# Altium schematic sheet AutomationSystem-Schematic_2022-08-13.schdoc
size 299 x 210 mm
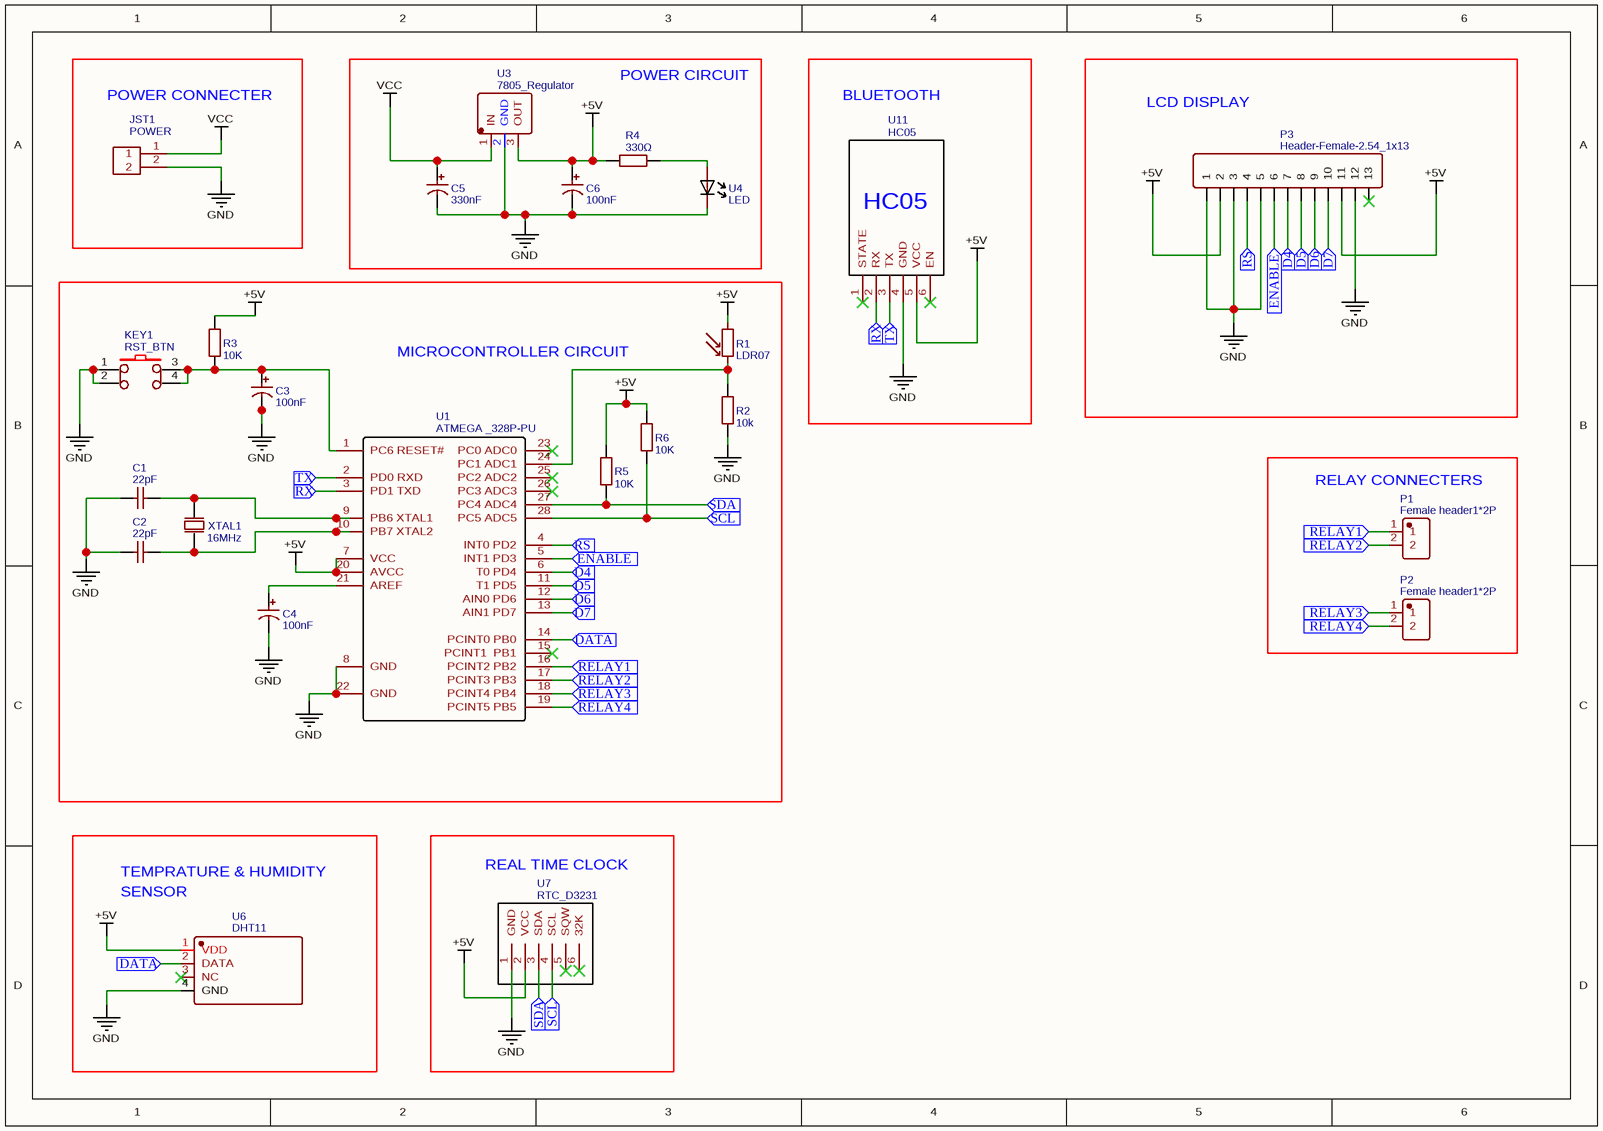
[diagram p0: AutomationSystem-Schematic_2022-08-13.schdoc]

## Parts
C1  22pF  [CAP-TH_L3.5-W3.0-P2.54-D0.8]
C2  22pF  [CAP-TH_L3.5-W3.0-P2.54-D0.8]
C3  100nF  [CAP-TH_BD5.0-P2.00-D0.8-FD]
C4  100nF  [CAP-TH_BD5.0-P2.00-D0.8-FD]
C5  330nF  [CAP-TH_BD5.0-P2.00-D0.8-FD]
C6  100nF  [CAP-TH_BD5.0-P2.00-D0.8-FD]
JST1  POWER  [CONN-TH_XHB-2A]
KEY1  RST_BTN  [KEY-TH_4P-L6.0-W6.0-P4.50]
P1  Female header1*2P  [HDR-TH_2P-P2.00-V]
P2  Female header1*2P  [HDR-TH_2P-P2.00-V]
P3  Header-Female-2.54_1x13  [HDR-TH_13P-P2.54-V-F]
R1  LDR07  [RESISTOR_LDR_5.1X4.3_RM3.4]
R2  10k  [AXIAL-0.4]
R3  10K  [AXIAL-0.4]
R4  330Ω  [AXIAL-0.4]
R5  10K  [AXIAL-0.4]
R6  10K  [AXIAL-0.4]
U1  ATMEGA _328P-PU  [DIP-28_L34.6-W7.3-P2.54-LS10.2-BL]
U3  7805_Regulator  [TO-220-3_L10.0-W4.5-P2.54-L]
U4  LED  [5MM LED]
U6  DHT11  [SENSOR-TH_DHT11]
U7  RTC_D3231  [D3231]
U11  HC05  [HC05]
XTAL1  16MHz  [16MHZ_OSC [PCB]]

## Blocks framed on the sheet
POWER CONNECTER: JST1
POWER CIRCUIT: C5 C6 R4 U3 U4
BLUETOOTH: U11
LCD DISPLAY: P3
MICROCONTROLLER CIRCUIT: C1-C4 KEY1 R1-R3 R5 R6 U1 XTAL1
RELAY CONNECTERS: P1 P2
REAL TIME CLOCK: U7

## Ports
D4 (in), D5 (in), D6 (in), D7 (in), DATA (in), ENABLE (in), RELAY1 (in), RELAY2 (in), RELAY3 (in), RELAY4 (in), RS (in), RX (in), SCL (in), SDA (in), TX (in)

## Nets
+5V: C6.1 P3.2 P3.11 R1.1 R3.2 R4.1 R5.2 R6.2 U1.7(VCC) U1.20(AVCC) U3.3(OUT) U6.1(VDD) U7.2(VCC) U11.5(VCC)
GND: C1.1 C2.1 C3.2 C4.2 C5.2 C6.2 JST1.2 KEY1.1 KEY1.2 P3.1 P3.3 P3.5 P3.12 R2.1 U1.8(GND) U1.22(GND) U3.2(GND) U4.2 U6.4(GND) U7.1(GND) U11.4(GND)
VCC: C5.1 JST1.1 U3.1(IN)
D4: P3.7 U1.6(T0_PD4) ; port D4
D5: P3.8 U1.11(T1_PD5) ; port D5
D6: P3.9 U1.12(AIN0_PD6) ; port D6
D7: P3.10 U1.13(AIN1_PD7) ; port D7
DATA: U1.14(PCINT0_PB0) U6.2(DATA) ; port DATA
ENABLE: P3.6 U1.5(INT1_PD3) ; port ENABLE
RELAY1: P1.1 U1.16(PCINT2_PB2) ; port RELAY1
RELAY2: P1.2 U1.17(PCINT3_PB3) ; port RELAY2
RELAY3: P2.1 U1.18(PCINT4_PB4) ; port RELAY3
RELAY4: P2.2 U1.19(PCINT5_PB5) ; port RELAY4
RS: P3.4 U1.4(INT0_PD2) ; port RS
RX: U1.3(PD1_TXD) U11.2(RX) ; port RX
SCL: R6.1 U1.28(PC5_ADC5) U7.4(SCL) ; port SCL
SDA: R5.1 U1.27(PC4_ADC4) U7.3(SDA) ; port SDA
TX: U1.2(PD0_RXD) U11.3(TX) ; port TX
NetC1_2: C1.2 U1.9(PB6_XTAL1) XTAL1.1(OSC1)
NetC2_2: C2.2 U1.10(PB7_XTAL2) XTAL1.2(OSC2)
NetC3_1: C3.1 KEY1.3 KEY1.4 R3.1 U1.1(PC6_RESET#)
NetC4_1: C4.1 U1.21(AREF)
NetR1_2: R1.2 R2.2 U1.24(PC1_ADC1)
NetR4_2: R4.2 U4.1

Not connected (* = marked no-connect by the designer): P3 13*; U1 15(PCINT1__PB1)* 23(PC0_ADC0)* 25(PC2_ADC2)* 26(PC3_ADC3)*; U6 3(NC)*; U7 5(SQW)* 6(32K)*; U11 1(STATE)* 6(EN)*

## Notes on the sheet
- TEMPRATURE & HUMIDITY
- SENSOR

## Library data of the parts
C1 C2 = 22pF: BOM_Manufacturer: ReliaPro; BOM_Manufacturer Part: 22pf/50V 10%; nameAlias: Capacitance; BOM_Supplier: LCSC; BOM_Supplier Part: C9316; spicePre: C; spiceSymbolName: 22pF
C3 C4 C6 = 100nF: BOM_Manufacturer: ValuePro; BOM_Manufacturer Part: 0.1UF 50V; nameAlias: Capacitance; BOM_Supplier: LCSC; BOM_Supplier Part: C28061; BOM_JLCPCB Part Class: Extended Part; spicePre: C; spiceSymbolName: 0.1uF
C5 = 330nF: BOM_Manufacturer: ValuePro; BOM_Manufacturer Part: 0.33uF 50V 5*11; nameAlias: Capacitance; BOM_Supplier: LCSC; BOM_Supplier Part: C45097; BOM_JLCPCB Part Class: Extended Part; spicePre: C; spiceSymbolName: 0.33uF
JST1 = POWER: BOM_Manufacturer: BOOMELE; BOM_Manufacturer Part: XHB-2A Connector; BOM_Supplier: LCSC; image: //image.lceda.cn/szlcsc/C57981.jpg; BOM_Supplier Part: C57981; BOM_JLCPCB Part Class: Extended Part; spicePre: C; spiceSymbolName: JST_2 PIN
KEY1 = RST_BTN: BOM_Manufacturer: ReliaPro; BOM_Manufacturer Part: button6*6*8.5; BOM_Supplier Part: C59980; BOM_Supplier: LCSC; image: http://image.lceda.cn/szlcsc/C59980.jpg; spicePre: K; spiceSymbolName: Push_Button
P1 P2 = Female header1*2P: BOM_Manufacturer: BOOMELE; BOM_Supplier: LCSC; BOM_Manufacturer Part: Female header1*2P; BOM_Supplier Part: C66509; BOM_JLCPCB Part Class: Extended Part; spicePre: P; spiceSymbolName: Female header1*2P
P3 = Header-Female-2.54_1x13: BOM_Manufacturer: BOOMELE; BOM_Manufacturer Part: Female header 2.54-1*13P; BOM_Supplier: LCSC; BOM_Supplier Part: C52709; BOM_JLCPCB Part Class: Extended Part; spicePre: P; spiceSymbolName: Header-Female-2.54_1x13
R1 = LDR07: Contributor: KiCAD; license: https://www.gnu.org/licenses/lgpl-2.1.html; spicePre: R; spiceSymbolName: LDR07
R2 = 10k: BOM_Manufacturer: UniOhm; BOM_Manufacturer Part: MFR0W4F2200A50; Power: 1/4W; Tolerance: ±1%; BOM_EasyEDA: E57439; Value: Value; BOM_Supplier Part: E57439; BOM_Supplier: EasyEDA; spicePre: R; spiceSymbolName: RESISTOR
R3 R5 R6 = 10K: BOM_Manufacturer: UniOhm; BOM_Manufacturer Part: MFR0W4F2200A50; Power: 1/4W; Tolerance: ±1%; BOM_EasyEDA: E57439; Value: Value; BOM_Supplier Part: E57439; BOM_Supplier: EasyEDA; spicePre: R; spiceSymbolName: RESISTOR
R4 = 330Ω: BOM_Manufacturer: UniOhm; BOM_Manufacturer Part: MFR0W4F2200A50; Power: 1/4W; Tolerance: ±1%; BOM_EasyEDA: E57439; Value: Value; BOM_Supplier Part: E57439; BOM_Supplier: EasyEDA; spicePre: R; spiceSymbolName: RESISTOR
U1 = ATMEGA _328P-PU: BOM_Manufacturer: MICROCHIP; BOM_Manufacturer Part: ATMEGA328P-PU; sourceId: Oic6oiASL; Contributor: LCSC; timeStamp: 1451725987; BOM_Supplier: LCSC; image: //image.lceda.cn/szlcsc/C33901.jpg; BOM_Supplier Part: C33901; spicePre: U; spiceSymbolName: ATMEGA _328P-PU
U3 = 7805_Regulator: BOM_Manufacturer: Foshan Blue Rocket Elec; BOM_Manufacturer Part: 7805; Contributor: LCSC; BOM_Supplier: LCSC; BOM_Supplier Part: C305416; BOM_JLCPCB Part Class: Extended Part; spicePre: U; spiceSymbolName: 7805_Regulator
U4 = LED: Contributor: Axbri; BOM_Manufacturer Part: 5mm LED; spicePre: U; spiceSymbolName: LED
U6 = DHT11: BOM_Manufacturer: Aosong (Guangzhou) Elec; Contributor: LCSC; BOM_Supplier: LCSC; BOM_Supplier Part: C117051; BOM_Manufacturer Part: DHT11; BOM_JLCPCB Part Class: Extended Part; spicePre: U; spiceSymbolName: DHT11
U7 = RTC_D3231: Contributor: tim_hcs; spicePre: U; spiceSymbolName: D3231
U11 = HC05: Contributor: marciofaccin; spicePre: U; spiceSymbolName: HC05
XTAL1 = 16MHz: BOM_Manufacturer: SHIVRAM; BOM_Manufacturer Part: 0SC-16MHz; nameAlias: Frequency; Contributor: Mantas Petrauskas; BOM_Supplier: SHIVRAM; BOM_Supplier Part: 0SC-16MHz; spicePre: X; spiceSymbolName: Crystal Oscillator